# Altium schematic sheet FPGA.SCHDOC
size B
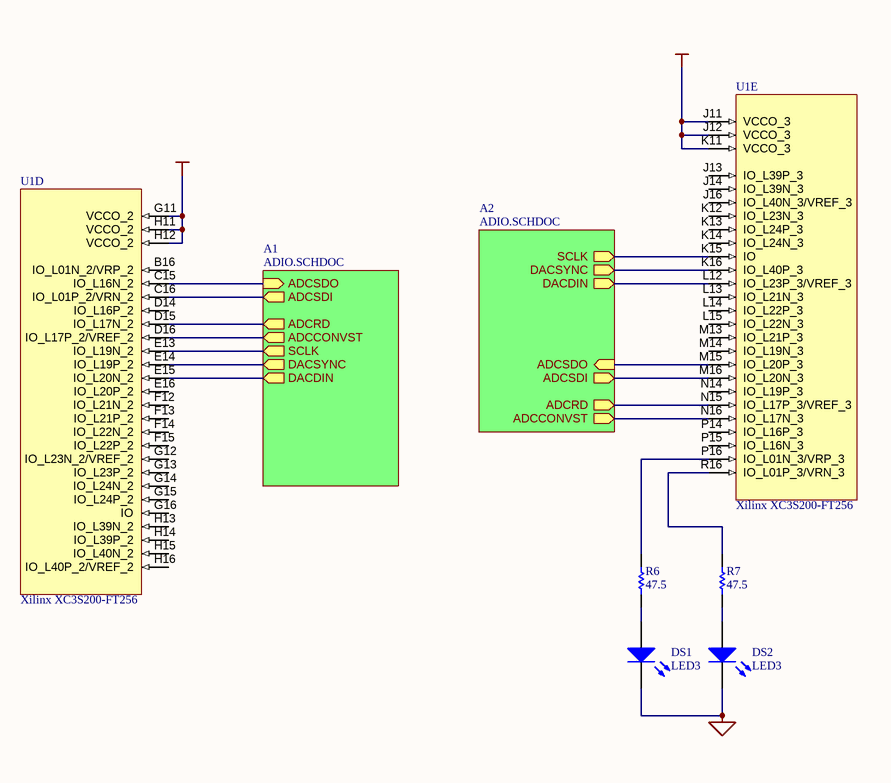
[diagram p0: FPGA.SCHDOC]

## Parts
DS1  LED3  [SMD _LED]
DS2  LED3  [SMD _LED]
R6  value 47.5  [0603]  (hidden comment: current-limiting series res)
R7  value 47.5  [0603]  (hidden comment: current-limiting series res)
U1  Xilinx XC3S200-FT256  [Xilinx FT256 BGA]  (parts D,E of 9)

## Sub-sheets
A1 = ADIO.SCHDOC: ADCCONVST (out), SCLK (out), DACSYNC (out), DACDIN (out), ADCSDO (in), ADCSDI (out), ADCRD (out)
A2 = ADIO.SCHDOC: ADCCONVST (out), SCLK (out), DACSYNC (out), DACDIN (out), ADCSDO (in), ADCSDI (out), ADCRD (out)

## Nets
GND: DS1.2(K) DS2.2(K)
VCC: U1.G11(VCCO_2) U1.H11(VCCO_2) U1.H12(VCCO_2) U1.J11(VCCO_3) U1.J12(VCCO_3) U1.K11(VCCO_3)
NetDS1_1: DS1.1(A) R6.2
NetDS2_1: DS2.1(A) R7.2
NetR6_1: R6.1 U1.P16(IO_L01N_3/VRP_3)
NetR7_1: R7.1 U1.R16(IO_L01P_3/VRN_3)
NetU1_C15: U1.C15(IO_L16N_2) ; sheet A1/ADCSDO
NetU1_C16: U1.C16(IO_L01P_2/VRN_2) ; sheet A1/ADCSDI
NetU1_D15: U1.D15(IO_L17N_2) ; sheet A1/ADCRD
NetU1_D16: U1.D16(IO_L17P_2/VREF_2) ; sheet A1/ADCCONVST
NetU1_E13: U1.E13(IO_L19N_2) ; sheet A1/SCLK
NetU1_E14: U1.E14(IO_L19P_2) ; sheet A1/DACSYNC
NetU1_E15: U1.E15(IO_L20N_2) ; sheet A1/DACDIN
NetU1_K15: U1.K15(IO) ; sheet A2/SCLK
NetU1_K16: U1.K16(IO_L40P_3) ; sheet A2/DACSYNC
NetU1_L12: U1.L12(IO_L23P_3/VREF_3) ; sheet A2/DACDIN
NetU1_M15: U1.M15(IO_L20P_3) ; sheet A2/ADCSDO
NetU1_M16: U1.M16(IO_L20N_3) ; sheet A2/ADCSDI
NetU1_N15: U1.N15(IO_L17P_3/VREF_3) ; sheet A2/ADCRD
NetU1_N16: U1.N16(IO_L17N_3) ; sheet A2/ADCCONVST

Not connected (* = marked no-connect by the designer): U1 B16(IO_L01N_2/VRP_2) D14(IO_L16P_2) E16(IO_L20P_2) F12(IO_L21N_2) F13(IO_L21P_2) F14(IO_L22N_2) F15(IO_L22P_2) G12(IO_L23N_2/VREF_2) G13(IO_L23P_2) G14(IO_L24N_2) G15(IO_L24P_2) G16(IO) H13(IO_L39N_2) H14(IO_L39P_2) H15(IO_L40N_2) H16(IO_L40P_2/VREF_2) J13(IO_L39P_3) J14(IO_L39N_3) J16(IO_L40N_3/VREF_3) K12(IO_L23N_3) K13(IO_L24P_3) K14(IO_L24N_3) L13(IO_L21N_3) L14(IO_L22P_3) L15(IO_L22N_3) M13(IO_L21P_3) M14(IO_L19N_3) N14(IO_L19P_3) P14(IO_L16P_3) P15(IO_L16N_3)

## Notes on the sheet
- Title:
- Engineer:
- Date:
- Revision:
- Sheet
- of
- File:

## Library data of the parts
DS1 DS2 = LED3: Typical BLUE SiC LED; Published: 8-Jun-2000; LatestRevisionDate: 17-Dec-2003; LatestRevisionNote: PCB Footprint replaced.; Publisher: Altium Limited
R6 R7 = RESISTOR: Standard Passive Resistor; Tolerance: 1%
U1 = XC3S200-FT256: Xilinx Spartan-3 FPGA